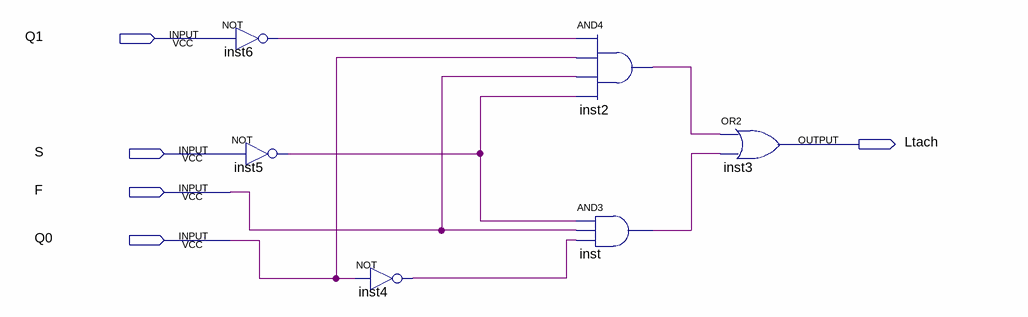
[diagram p0: schematic sheet]
// Quartus schematic Latch.bdf as structural Verilog: 6 symbols, 5 pins
module Latch (
  input  Q1,
  input  S,
  input  F,
  input  Q0,
  output Ltach
);

  wire inst2_out, inst4_out, inst5_out, inst6_out, inst_out;

  not inst6 (inst6_out, Q1);
  not inst5 (inst5_out, S);
  not inst4 (inst4_out, Q0);
  and inst2 (inst2_out, inst6_out, Q0, F, inst5_out);
  and inst (inst_out, inst5_out, F, inst4_out);
  or inst3 (Ltach, inst2_out, inst_out);
endmodule
